# Altium schematic sheet main.SchDoc
size Letter
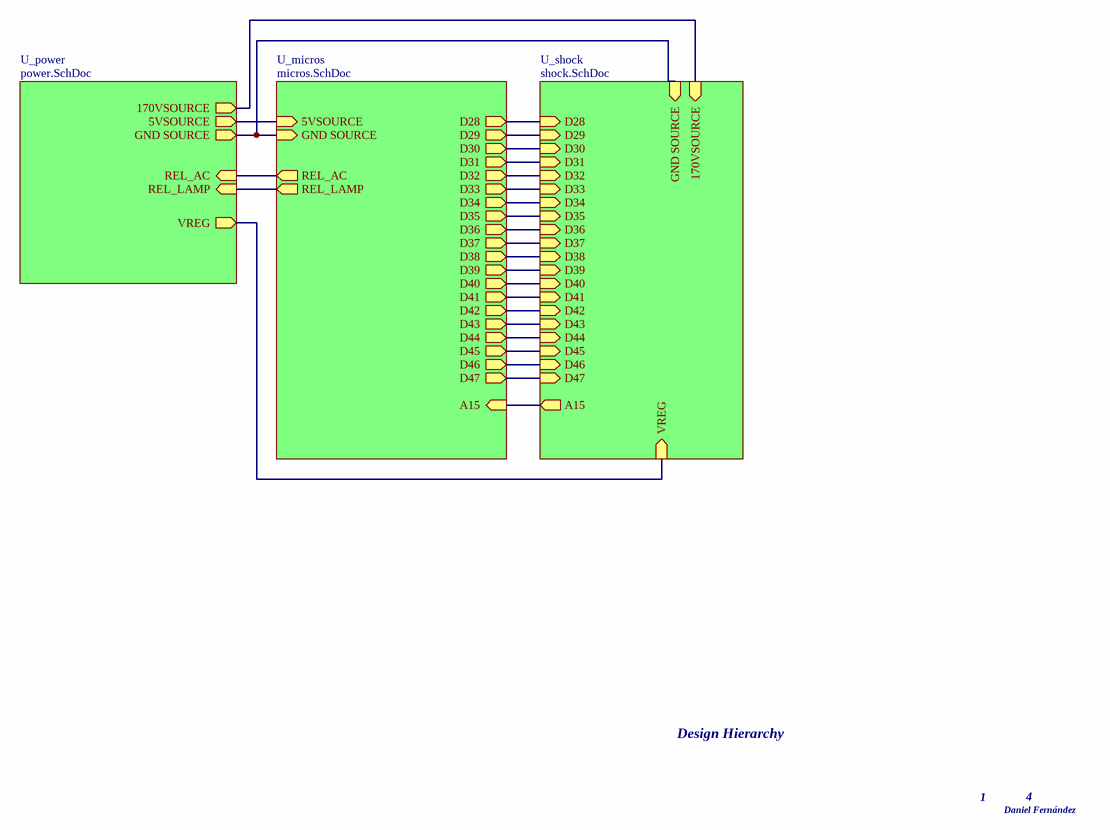
[diagram p0: main.SchDoc]

## Sub-sheets
U_micros = micros.SchDoc: GND SOURCE (in), 5VSOURCE (in), REL_AC (out), REL_LAMP (out), D28 (out), D29 (out), D30 (out), D31 (out), D32 (out), D33 (out), D34 (out), D35 (out), D36 (out), D37 (out), D38 (out), D39 (out), D40 (out), D41 (out), D42 (out), D43 (out), D44 (out), D45 (out), D46 (out), D47 (out), A15 (in)
U_power = power.SchDoc: REL_AC (in), REL_LAMP (in), 5VSOURCE (out), 170VSOURCE (out), GND SOURCE (out), VREG (out)
U_shock = shock.SchDoc: D28 (in), GND SOURCE (in), D29 (in), D30 (in), D31 (in), D32 (in), D33 (in), D34 (in), D35 (in), D36 (in), D37 (in), D38 (in), D39 (in), D40 (in), D41 (in), D42 (in), D43 (in), D44 (in), D45 (in), D46 (in), D47 (in), 170VSOURCE (in), A15 (out), VREG (in)

## Nets
(unnamed): sheet U_power/REL_AC, sheet U_micros/REL_AC
(unnamed): sheet U_power/REL_LAMP, sheet U_micros/REL_LAMP
(unnamed): sheet U_power/5VSOURCE, sheet U_micros/5VSOURCE
(unnamed): sheet U_power/170VSOURCE, sheet U_shock/170VSOURCE
(unnamed): sheet U_power/GND SOURCE, sheet U_micros/GND SOURCE, sheet U_shock/GND SOURCE
(unnamed): sheet U_power/VREG, sheet U_shock/VREG
(unnamed): sheet U_micros/D28, sheet U_shock/D28
(unnamed): sheet U_micros/D29, sheet U_shock/D29
(unnamed): sheet U_micros/D30, sheet U_shock/D30
(unnamed): sheet U_micros/D31, sheet U_shock/D31
(unnamed): sheet U_micros/D32, sheet U_shock/D32
(unnamed): sheet U_micros/D33, sheet U_shock/D33
(unnamed): sheet U_micros/D34, sheet U_shock/D34
(unnamed): sheet U_micros/D35, sheet U_shock/D35
(unnamed): sheet U_micros/D36, sheet U_shock/D36
(unnamed): sheet U_micros/D37, sheet U_shock/D37
(unnamed): sheet U_micros/D38, sheet U_shock/D38
(unnamed): sheet U_micros/D39, sheet U_shock/D39
(unnamed): sheet U_micros/D40, sheet U_shock/D40
(unnamed): sheet U_micros/D41, sheet U_shock/D41
(unnamed): sheet U_micros/D42, sheet U_shock/D42
(unnamed): sheet U_micros/D43, sheet U_shock/D43
(unnamed): sheet U_micros/D44, sheet U_shock/D44
(unnamed): sheet U_micros/D45, sheet U_shock/D45
(unnamed): sheet U_micros/D46, sheet U_shock/D46
(unnamed): sheet U_micros/D47, sheet U_shock/D47
(unnamed): sheet U_micros/A15, sheet U_shock/A15

## Notes on the sheet
- Design Hierarchy
- 1
- Daniel Fernández
- 4
- Title
- Size:
- Date:
- Letter
- Number:
- Time:
- Revision:
- Sheet
- of
- File: